# EAGLE schematic GBARPi (EAGLE 9.6.2)

## Sheet 1 of 3
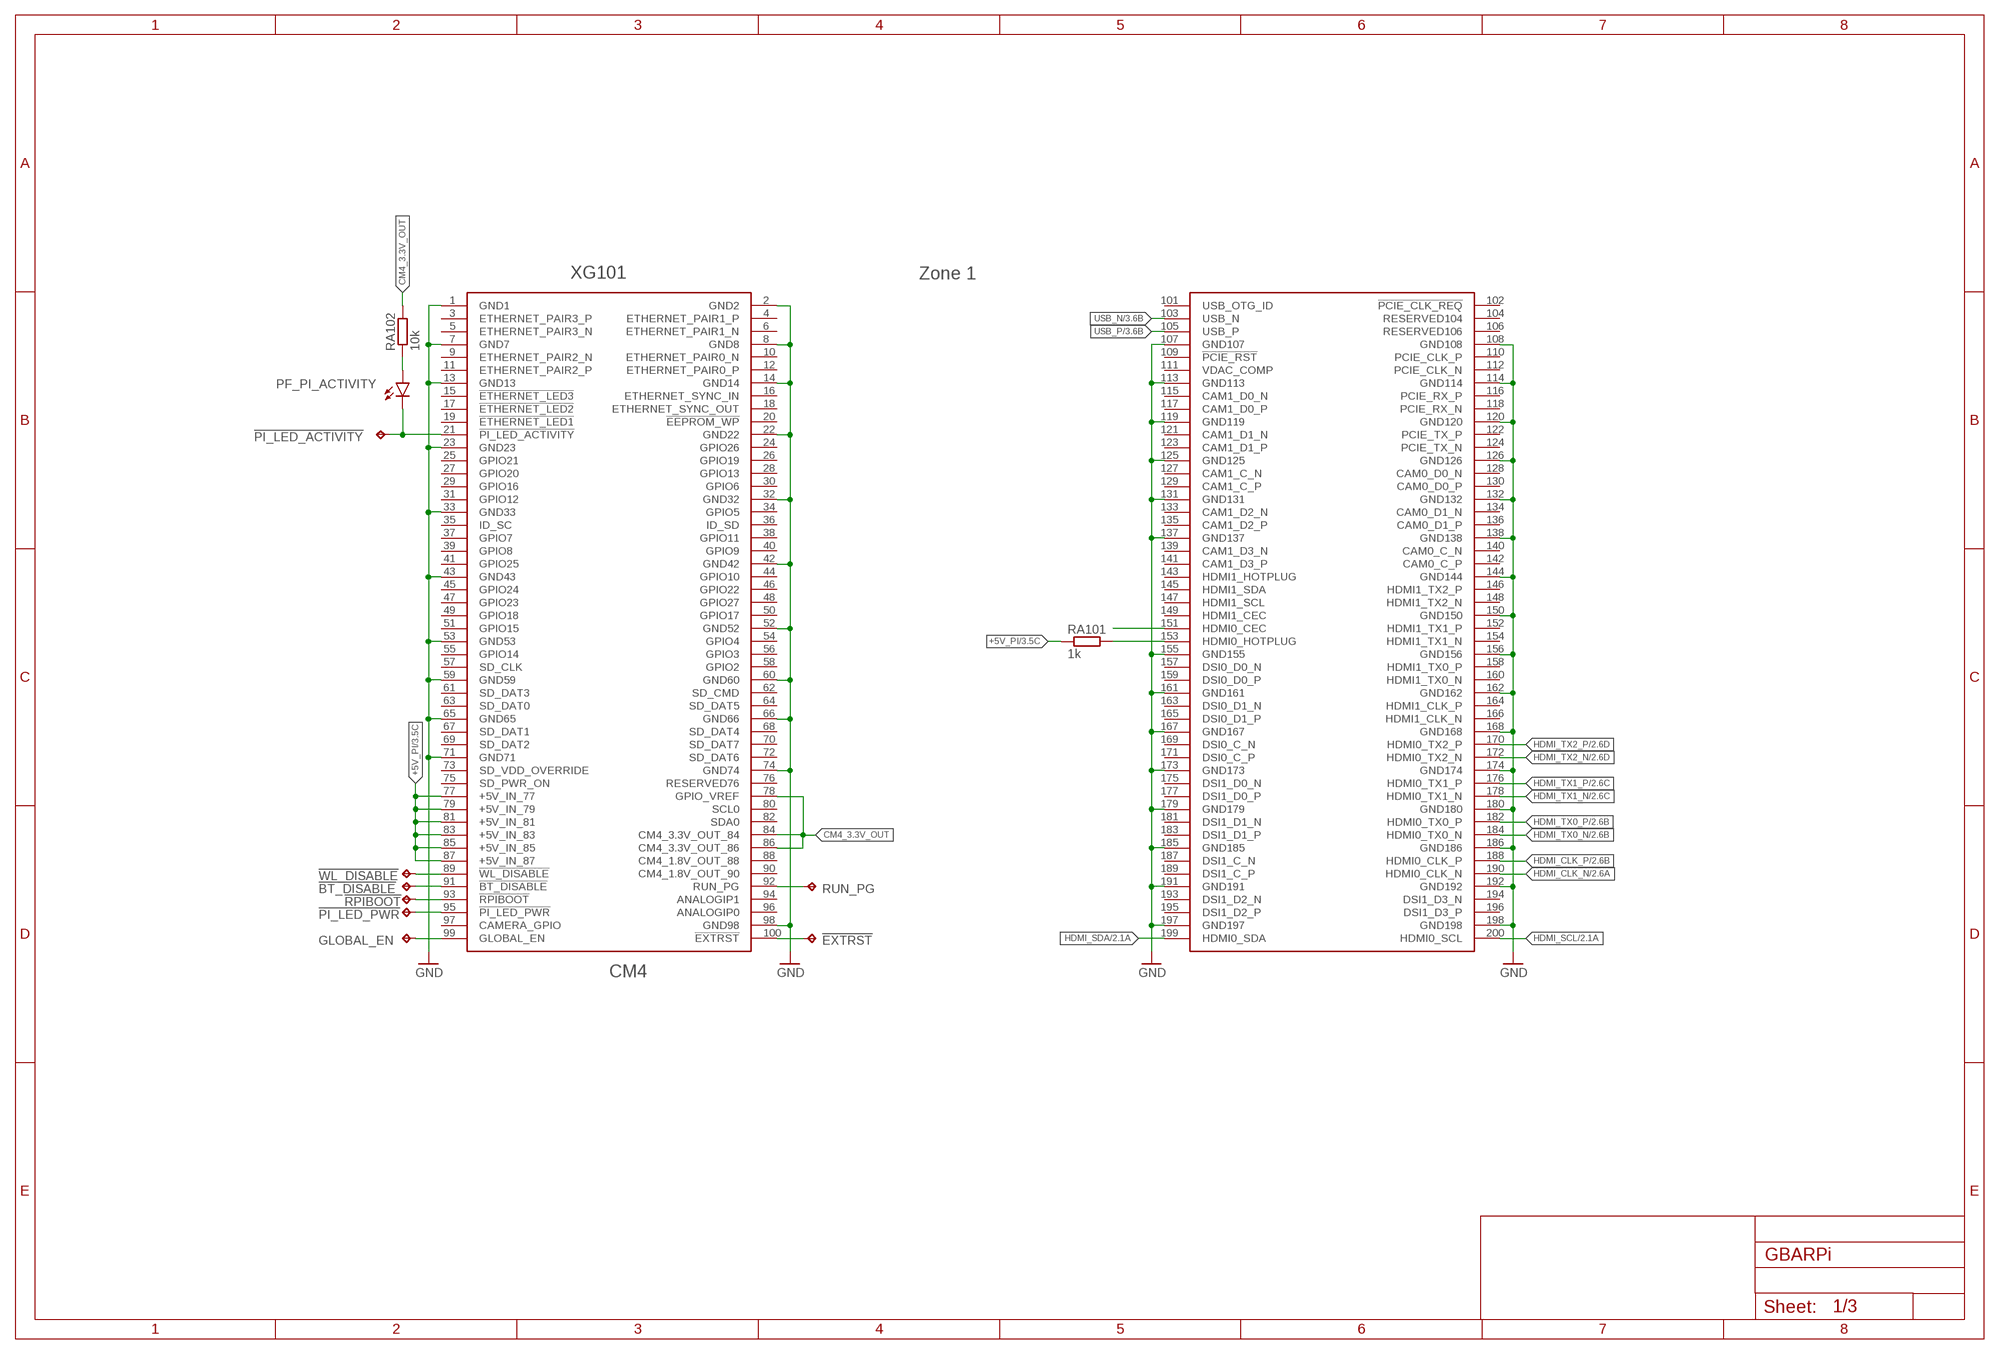
[diagram p0: schematic, sheet 1]

### Parts
!BT_DISABLE  TPB1,27  [B1,27]
!EXTRST  TPB1,27  [B1,27]
!PI_LED_ACTIVITY  TPB1,27  [B1,27]
!PI_LED_PWR  TPB1,27  [B1,27]
!RPIBOOT  TPB1,27  [B1,27]
!WL_DISABLE  TPB1,27  [B1,27]
GLOBAL_EN  TPB1,27  [B1,27]
PF_PI_ACTIVITY  LEDCHIP-LED0603  [CHIP-LED0603]
RA101  1k  R-EU_R0402  [R0402]
RA102  10k  R-EU_R0402  [R0402]
RUN_PG  TPB1,27  [B1,27]
XG101  CM4  [CM4]

### Nets
!BT_DISABLE: !BT_DISABLE.TP XG101.91(!BT_DISABLE)
!EXTRST: !EXTRST.TP XG101.100(!EXTRST)
!PI_LED_ACTIVITY: !PI_LED_ACTIVITY.TP PF_PI_ACTIVITY.C XG101.21(!PI_LED_ACTIVITY)
!PI_LED_PWR: !PI_LED_PWR.TP XG101.95(!PI_LED_PWR)
!RPIBOOT: !RPIBOOT.TP XG101.93(!RPIBOOT)
!WL_DISABLE: !WL_DISABLE.TP XG101.89(!WL_DISABLE)
+5V_PI: RA101.1 XG101.77(+5V_IN_77) XG101.79(+5V_IN_79) XG101.81(+5V_IN_81) XG101.83(+5V_IN_83) XG101.85(+5V_IN_85) XG101.87(+5V_IN_87) ; also sheet 3
CM4_3.3V_OUT: RA102.2 XG101.78(GPIO_VREF) XG101.84(CM4_3.3V_OUT_84) XG101.86(CM4_3.3V_OUT_86)
GLOBAL_EN: GLOBAL_EN.TP XG101.99(GLOBAL_EN)
GND: XG101.1(GND1) XG101.2(GND2) XG101.7(GND7) XG101.8(GND8) XG101.13(GND13) XG101.14(GND14) XG101.22(GND22) XG101.23(GND23) XG101.32(GND32) XG101.33(GND33) XG101.42(GND42) XG101.43(GND43) XG101.52(GND52) XG101.53(GND53) XG101.59(GND59) XG101.60(GND60) XG101.65(GND65) XG101.66(GND66) XG101.71(GND71) XG101.74(GND74) XG101.98(GND98) XG101.107(GND107) XG101.108(GND108) XG101.113(GND113) XG101.114(GND114) XG101.119(GND119) XG101.120(GND120) XG101.125(GND125) XG101.126(GND126) XG101.131(GND131) XG101.132(GND132) XG101.137(GND137) XG101.138(GND138) XG101.144(GND144) XG101.150(GND150) XG101.155(GND155) XG101.156(GND156) XG101.161(GND161) XG101.162(GND162) XG101.167(GND167) XG101.168(GND168) XG101.173(GND173) XG101.174(GND174) XG101.179(GND179) XG101.180(GND180) XG101.185(GND185) XG101.186(GND186) XG101.191(GND191) XG101.192(GND192) XG101.197(GND197) XG101.198(GND198) ; also sheet 2,3
HDMI_CLK_N [HDMI]: XG101.190(HDMI0_CLK_N) ; also sheet 2
HDMI_CLK_P [HDMI]: XG101.188(HDMI0_CLK_P) ; also sheet 2
HDMI_SCL: XG101.200(HDMI0_SCL) ; also sheet 2
HDMI_SDA: XG101.199(HDMI0_SDA) ; also sheet 2
HDMI_TX0_N [HDMI]: XG101.184(HDMI0_TX0_N) ; also sheet 2
HDMI_TX0_P [HDMI]: XG101.182(HDMI0_TX0_P) ; also sheet 2
HDMI_TX1_N [HDMI]: XG101.178(HDMI0_TX1_N) ; also sheet 2
HDMI_TX1_P [HDMI]: XG101.176(HDMI0_TX1_P) ; also sheet 2
HDMI_TX2_N [HDMI]: XG101.172(HDMI0_TX2_N) ; also sheet 2
HDMI_TX2_P [HDMI]: XG101.170(HDMI0_TX2_P) ; also sheet 2
N$1: XG101.151(HDMI0_CEC)
N$2: RA101.2 XG101.153(HDMI0_HOTPLUG)
N$12: PF_PI_ACTIVITY.A RA102.1
RUN_PG: RUN_PG.TP XG101.92(RUN_PG)
USB_N [USB]: XG101.103(USB_N) ; also sheet 3
USB_P [USB]: XG101.105(USB_P) ; also sheet 3
Unconnected: XG101.3(ETHERNET_PAIR3_P) XG101.4(ETHERNET_PAIR1_P) XG101.5(ETHERNET_PAIR3_N) XG101.6(ETHERNET_PAIR1_N) XG101.9(ETHERNET_PAIR2_N) XG101.10(ETHERNET_PAIR0_N) XG101.11(ETHERNET_PAIR2_P) XG101.12(ETHERNET_PAIR0_P) XG101.15(!ETHERNET_LED3) XG101.16(ETHERNET_SYNC_IN) XG101.17(!ETHERNET_LED2) XG101.18(ETHERNET_SYNC_OUT) XG101.19(!ETHERNET_LED1) XG101.20(!EEPROM_WP) XG101.24(GPIO26) XG101.25(GPIO21) XG101.26(GPIO19) XG101.27(GPIO20) XG101.28(GPIO13) XG101.29(GPIO16) XG101.30(GPIO6) XG101.31(GPIO12) XG101.34(GPIO5) XG101.35(ID_SC) XG101.36(ID_SD) XG101.37(GPIO7) XG101.38(GPIO11) XG101.39(GPIO8) XG101.40(GPIO9) XG101.41(GPIO25) XG101.44(GPIO10) XG101.45(GPIO24) XG101.46(GPIO22) XG101.47(GPIO23) XG101.48(GPIO27) XG101.49(GPIO18) XG101.50(GPIO17) XG101.51(GPIO15) XG101.54(GPIO4) XG101.55(GPIO14) XG101.56(GPIO3) XG101.57(SD_CLK) XG101.58(GPIO2) XG101.61(SD_DAT3) XG101.62(SD_CMD) XG101.63(SD_DAT0) XG101.64(SD_DAT5) XG101.67(SD_DAT1) XG101.68(SD_DAT4) XG101.69(SD_DAT2) XG101.70(SD_DAT7) XG101.72(SD_DAT6) XG101.73(SD_VDD_OVERRIDE) XG101.75(SD_PWR_ON) XG101.76(RESERVED76) XG101.80(SCL0) XG101.82(SDA0) XG101.88(CM4_1.8V_OUT_88) XG101.90(CM4_1.8V_OUT_90) XG101.94(ANALOGIP1) XG101.96(ANALOGIP0) XG101.97(CAMERA_GPIO) XG101.101(USB_OTG_ID) XG101.102(!PCIE_CLK_REQ) XG101.104(RESERVED104) XG101.106(RESERVED106) XG101.109(!PCIE_RST) XG101.110(PCIE_CLK_P) XG101.111(VDAC_COMP) XG101.112(PCIE_CLK_N) XG101.115(CAM1_D0_N) XG101.116(PCIE_RX_P) XG101.117(CAM1_D0_P) XG101.118(PCIE_RX_N) XG101.121(CAM1_D1_N) XG101.122(PCIE_TX_P) XG101.123(CAM1_D1_P) XG101.124(PCIE_TX_N) XG101.127(CAM1_C_N) XG101.128(CAM0_D0_N) XG101.129(CAM1_C_P) XG101.130(CAM0_D0_P) XG101.133(CAM1_D2_N) XG101.134(CAM0_D1_N) XG101.135(CAM1_D2_P) XG101.136(CAM0_D1_P) XG101.139(CAM1_D3_N) XG101.140(CAM0_C_N) XG101.141(CAM1_D3_P) XG101.142(CAM0_C_P) XG101.143(HDMI1_HOTPLUG) XG101.145(HDMI1_SDA) XG101.146(HDMI1_TX2_P) XG101.147(HDMI1_SCL) XG101.148(HDMI1_TX2_N) XG101.149(HDMI1_CEC) XG101.152(HDMI1_TX1_P) XG101.154(HDMI1_TX1_N) XG101.157(DSI0_D0_N) XG101.158(HDMI1_TX0_P) XG101.159(DSI0_D0_P) XG101.160(HDMI1_TX0_N) XG101.163(DSI0_D1_N) XG101.164(HDMI1_CLK_P) XG101.165(DSI0_D1_P) XG101.166(HDMI1_CLK_N) XG101.169(DSI0_C_N) XG101.171(DSI0_C_P) XG101.175(DSI1_D0_N) XG101.177(DSI1_D0_P) XG101.181(DSI1_D1_N) XG101.183(DSI1_D1_P) XG101.187(DSI1_C_N) XG101.189(DSI1_C_P) XG101.193(DSI1_D2_N) XG101.194(DSI1_D3_N) XG101.195(DSI1_D2_P) XG101.196(DSI1_D3_P)

### Notes on the sheet
- Zone 1

## Sheet 2 of 3
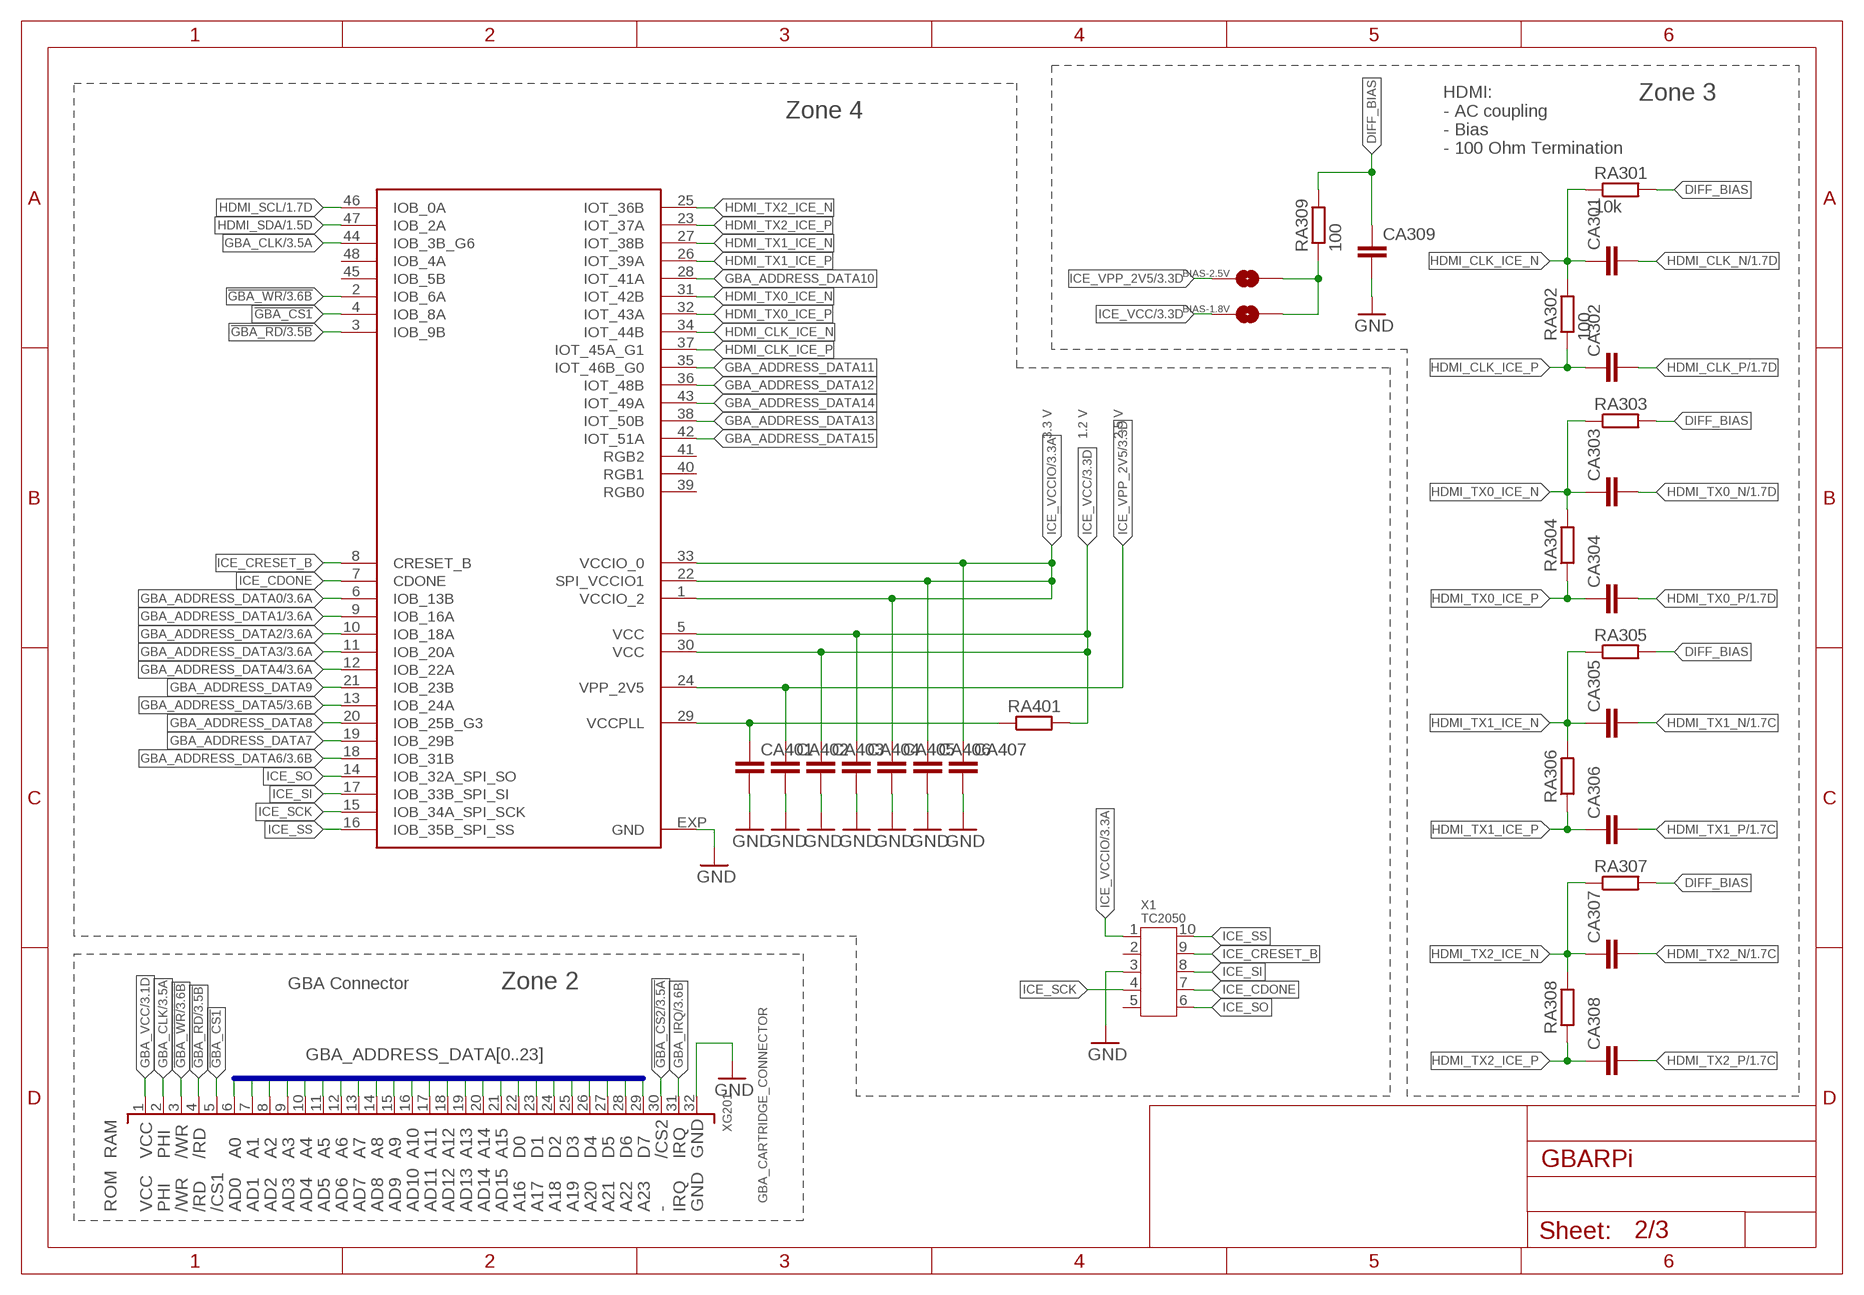
[diagram p1: schematic, sheet 2]

### Parts
BIAS-1.8V  SJS-NC3  [SJS-NC3]
BIAS-2.5V  SJ  [SJ]
CA301  C-EUC0402  [C0402]
CA302  C-EUC0402  [C0402]
CA303  C-EUC0402  [C0402]
CA304  C-EUC0402  [C0402]
CA305  C-EUC0402  [C0402]
CA306  C-EUC0402  [C0402]
CA307  C-EUC0402  [C0402]
CA308  C-EUC0402  [C0402]
CA309  C-EUC0402  [C0402]
CA401  C-EUC0402  [C0402]
CA402  C-EUC0402  [C0402]
CA403  C-EUC0402  [C0402]
CA404  C-EUC0402  [C0402]
CA405  C-EUC0402  [C0402]
CA406  C-EUC0402  [C0402]
CA407  C-EUC0402  [C0402]
KF401  ICE40UP5KSG48  [QFN50P700X700X100-49T535N]
RA301  10k  R-EU_R0402  [R0402]
RA302  100  R-EU_R0402  [R0402]
RA303  R-EU_R0402  [R0402]
RA304  R-EU_R0402  [R0402]
RA305  R-EU_R0402  [R0402]
RA306  R-EU_R0402  [R0402]
RA307  R-EU_R0402  [R0402]
RA308  R-EU_R0402  [R0402]
RA309  100  R-EU_R0402  [R0402]
RA401  R-EU_R0402  [R0402]
X1  TC2050  [TC2050]
XG201  GBA_CARTRIDGE_CONNECTOR  [GBA_CARTRIDGE_CONNECTOR]

### Nets
!GBA_CS1: KF401.4(IOB_8A) XG201.5(/RCS)
!GBA_CS2: XG201.30(/RS) ; also sheet 3
!GBA_RD: KF401.3(IOB_9B) XG201.4(/RD) ; also sheet 3
!GBA_WR: KF401.2(IOB_6A) XG201.3(/WR) ; also sheet 3
DIFF_BIAS: CA309.1 RA301.2 RA303.2 RA305.2 RA307.2 RA309.2
GBA_ADDRESS_DATA0: KF401.6(IOB_13B) XG201.6(A0) ; also sheet 3
GBA_ADDRESS_DATA1: KF401.9(IOB_16A) XG201.7(A1) ; also sheet 3
GBA_ADDRESS_DATA2: KF401.10(IOB_18A) XG201.8(A2) ; also sheet 3
GBA_ADDRESS_DATA3: KF401.11(IOB_20A) XG201.9(A3) ; also sheet 3
GBA_ADDRESS_DATA4: KF401.12(IOB_22A) XG201.10(A4) ; also sheet 3
GBA_ADDRESS_DATA5: KF401.13(IOB_24A) XG201.11(A5) ; also sheet 3
GBA_ADDRESS_DATA6: KF401.18(IOB_31B) XG201.12(A6) ; also sheet 3
GBA_ADDRESS_DATA7: KF401.19(IOB_29B) XG201.13(A7)
GBA_ADDRESS_DATA8: KF401.20(IOB_25B_G3) XG201.14(A8)
GBA_ADDRESS_DATA9: KF401.21(IOB_23B) XG201.15(A9)
GBA_ADDRESS_DATA10: KF401.28(IOT_41A) XG201.16(A10)
GBA_ADDRESS_DATA11: KF401.35(IOT_46B_G0) XG201.17(A11)
GBA_ADDRESS_DATA12: KF401.36(IOT_48B) XG201.18(A12)
GBA_ADDRESS_DATA13: KF401.38(IOT_50B) XG201.19(A13)
GBA_ADDRESS_DATA14: KF401.43(IOT_49A) XG201.20(A14)
GBA_ADDRESS_DATA15: KF401.42(IOT_51A) XG201.21(A15)
GBA_ADDRESS_DATA16: XG201.22(D0) ; also sheet 3
GBA_ADDRESS_DATA17: XG201.23(D1) ; also sheet 3
GBA_ADDRESS_DATA18: XG201.24(D2) ; also sheet 3
GBA_ADDRESS_DATA19: XG201.25(D3) ; also sheet 3
GBA_ADDRESS_DATA20: XG201.26(D4) ; also sheet 3
GBA_ADDRESS_DATA21: XG201.27(D5) ; also sheet 3
GBA_ADDRESS_DATA22: XG201.28(D6) ; also sheet 3
GBA_ADDRESS_DATA23: XG201.29(D7) ; also sheet 3
GBA_CLK: KF401.44(IOB_3B_G6) XG201.2(NC) ; also sheet 3
GBA_IRQ: XG201.31(VIN) ; also sheet 3
GBA_VCC: XG201.1(VDD) ; also sheet 3
GND: CA309.2 CA401.2 CA402.2 CA403.2 CA404.2 CA405.2 CA406.2 CA407.2 KF401.EXP(GND) X1.3 XG201.32(GND) ; also sheet 1,3
HDMI_CLK_ICE_N [HDMI]: CA301.1 KF401.34(IOT_44B) RA301.1 RA302.2
HDMI_CLK_ICE_P [HDMI]: CA302.1 KF401.37(IOT_45A_G1) RA302.1
HDMI_CLK_N [HDMI]: CA301.2 ; also sheet 1
HDMI_CLK_P [HDMI]: CA302.2 ; also sheet 1
HDMI_SCL: KF401.46(IOB_0A) ; also sheet 1
HDMI_SDA: KF401.47(IOB_2A) ; also sheet 1
HDMI_TX0_ICE_N [HDMI]: CA303.1 KF401.31(IOT_42B) RA303.1 RA304.2
HDMI_TX0_ICE_P [HDMI]: CA304.1 KF401.32(IOT_43A) RA304.1
HDMI_TX0_N [HDMI]: CA303.2 ; also sheet 1
HDMI_TX0_P [HDMI]: CA304.2 ; also sheet 1
HDMI_TX1_ICE_N: CA305.1 KF401.27(IOT_38B) RA305.1 RA306.2
HDMI_TX1_ICE_P: CA306.1 KF401.26(IOT_39A) RA306.1
HDMI_TX1_N [HDMI]: CA305.2 ; also sheet 1
HDMI_TX1_P [HDMI]: CA306.2 ; also sheet 1
HDMI_TX2_ICE_N: CA307.1 KF401.25(IOT_36B) RA307.1 RA308.2
HDMI_TX2_ICE_P: CA308.1 KF401.23(IOT_37A) RA308.1
HDMI_TX2_N [HDMI]: CA307.2 ; also sheet 1
HDMI_TX2_P [HDMI]: CA308.2 ; also sheet 1
ICE_CDONE: KF401.7(CDONE) X1.7
ICE_CRESET_B: KF401.8(CRESET_B) X1.9
ICE_SCK: KF401.15(IOB_34A_SPI_SCK) X1.4
ICE_SI: KF401.17(IOB_33B_SPI_SI) X1.8
ICE_SO: KF401.14(IOB_32A_SPI_SO) X1.6
ICE_SS: KF401.16(IOB_35B_SPI_SS) X1.10
ICE_VCC: BIAS-1.8V.1 CA403.1 CA404.1 KF401.5(VCC) KF401.30(VCC) RA401.2 ; also sheet 3
ICE_VCCIO: CA405.1 CA406.1 CA407.1 KF401.1(VCCIO_2) KF401.22(SPI_VCCIO1) KF401.33(VCCIO_0) X1.1 ; also sheet 3
ICE_VPP_2V5: BIAS-2.5V.1 CA402.1 KF401.24(VPP_2V5) ; also sheet 3
N$11: BIAS-1.8V.2 BIAS-2.5V.2 RA309.1
VCCPLL: CA401.1 KF401.29(VCCPLL) RA401.1
Unconnected: KF401.39(RGB0) KF401.40(RGB1) KF401.41(RGB2) KF401.45(IOB_5B) KF401.48(IOB_4A) X1.2 X1.5

### Buses
GBA_ADDRESS_DATA[0..23]

### Notes on the sheet
- Zone 3
- Zone 4
- HDMI:
  - AC coupling
  - Bias
  - 100 Ohm Termination
- 3.3 V | 1.2 V | 2.5 V
- GBA Connector | Zone 2

## Sheet 3 of 3
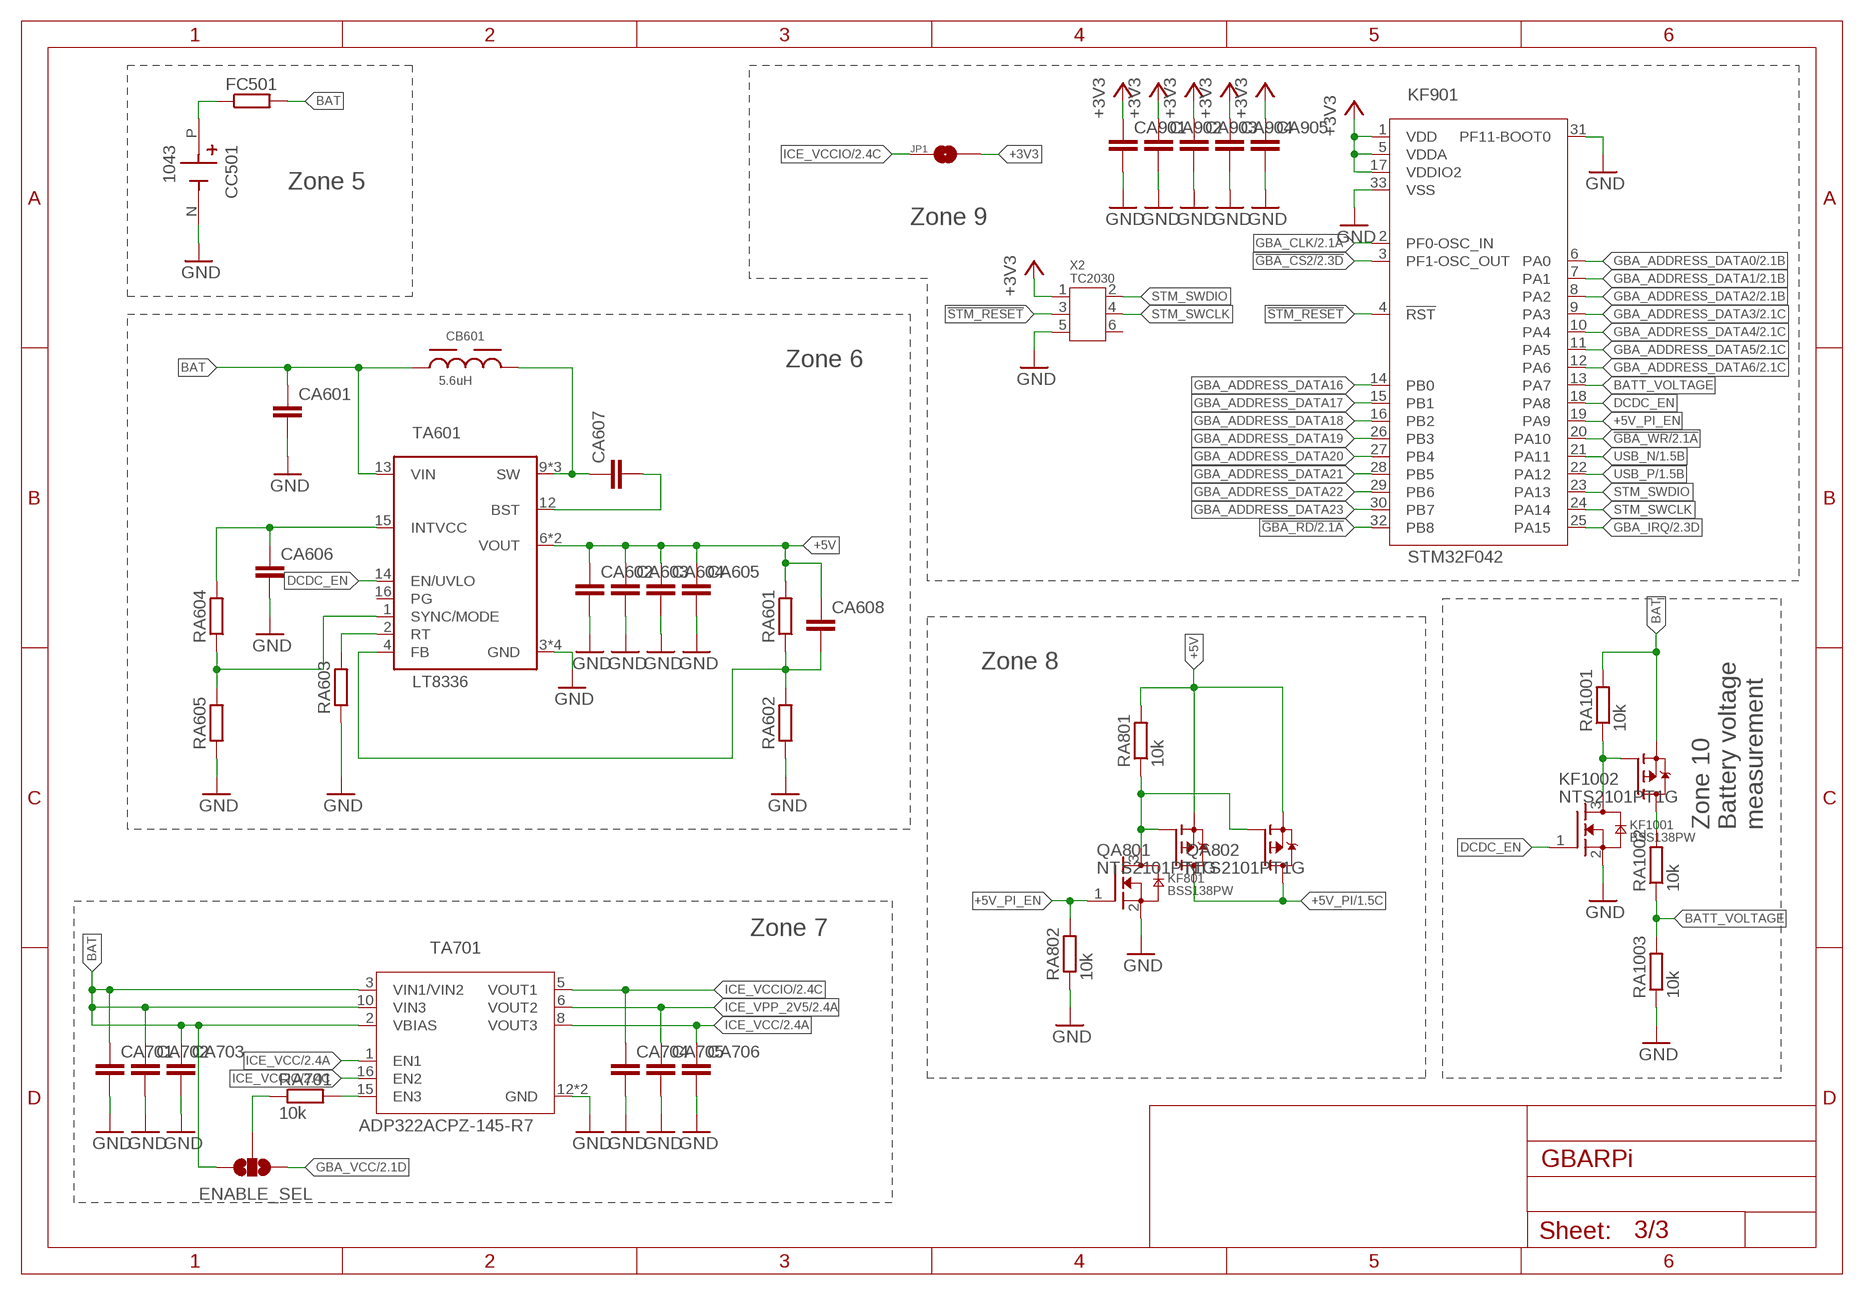
[diagram p2: schematic, sheet 3]

### Parts
CA601  C-EUC1206  [C1206]
CA602  C-EUC0603  [C0603]
CA603  C-EUC0603  [C0603]
CA604  C-EUC1206  [C1206]
CA605  C-EUC1206  [C1206]
CA606  C-EUC0402  [C0402]
CA607  C-EUC0402  [C0402]
CA608  C-EUC0402  [C0402]
CA701  C-EUC0402  [C0402]
CA702  C-EUC0402  [C0402]
CA703  C-EUC0402  [C0402]
CA704  C-EUC0402  [C0402]
CA705  C-EUC0402  [C0402]
CA706  C-EUC0402  [C0402]
CA901  C-EUC0402  [C0402]
CA902  C-EUC0402  [C0402]
CA903  C-EUC0402  [C0402]
CA904  C-EUC0402  [C0402]
CA905  C-EUC0402  [C0402]
CB601  5.6uH  WE-MAPI_4020_74438356056  [WE-MAPI_4020]
CC501  1043  [BAT_1043]
ENABLE_SEL  SJ2W  [SJ_2]
FC501  R-EU_R1206  [R1206]
JP1  SJS-NC3  [SJS-NC3]
KF801  BSS138PW  [SC70-3]
KF901  STM32F042  [QFN50P500X500X60-33T350N]
KF1001  BSS138PW  [SC70-3]
KF1002  NTS2101PT1G  [SC70-3]
QA801  NTS2101PT1G  [SC70-3]
QA802  NTS2101PT1G  [SC70-3]
RA601  R-EU_R0402  [R0402]
RA602  R-EU_R0402  [R0402]
RA603  R-EU_R0402  [R0402]
RA604  R-EU_R0402  [R0402]
RA605  R-EU_R0402  [R0402]
RA701  10k  R-EU_R0402  [R0402]
RA801  10k  R-EU_R0402  [R0402]
RA802  10k  R-EU_R0402  [R0402]
RA1001  10k  R-EU_R0402  [R0402]
RA1002  10k  R-EU_R0402  [R0402]
RA1003  10k  R-EU_R0402  [R0402]
TA601  LT8336  [LQFN16]
TA701  ADP322ACPZ-145-R7  ADP322ACPZ  [QFN50P300X300X80-17T175N]
X2  TC2030  [TC2030]

### Nets
!GBA_CS2: KF901.3(PF1-OSC_OUT) ; also sheet 2
!GBA_RD: KF901.32(PB8) ; also sheet 2
!GBA_WR: KF901.20(PA10) ; also sheet 2
!STM_RESET: KF901.4(!RST) X2.3
+3V3: CA901.1 CA902.1 CA903.1 CA904.1 CA905.1 JP1.2 KF901.1(VDD) KF901.5(VDDA) KF901.17(VDDIO2) X2.1
+5V: CA602.1 CA603.1 CA604.1 CA605.1 CA608.1 QA801.2(S) QA802.2(S) RA601.2 RA801.2 TA601.6(VOUT) TA601.7(VOUT)
+5V_PI: QA801.3(D) QA802.3(D) ; also sheet 1
+5V_PI_EN: KF801.1(G) KF901.19(PA9) RA802.2
BAT: CA601.1 CA701.1 CA702.1 CA703.1 CB601.1 ENABLE_SEL.3 FC501.2 KF1002.2(S) RA1001.2 TA601.13(VIN) TA701.2(VBIAS) TA701.3(VIN1/VIN2) TA701.10(VIN3)
BAT_UNFUSED: CC501.P FC501.1
BATT_VOLTAGE: KF901.13(PA7) RA1002.1 RA1003.2
DCDC_EN: KF901.18(PA8) KF1001.1(G) TA601.14(EN/UVLO)
GBA_ADDRESS_DATA0: KF901.6(PA0) ; also sheet 2
GBA_ADDRESS_DATA1: KF901.7(PA1) ; also sheet 2
GBA_ADDRESS_DATA2: KF901.8(PA2) ; also sheet 2
GBA_ADDRESS_DATA3: KF901.9(PA3) ; also sheet 2
GBA_ADDRESS_DATA4: KF901.10(PA4) ; also sheet 2
GBA_ADDRESS_DATA5: KF901.11(PA5) ; also sheet 2
GBA_ADDRESS_DATA6: KF901.12(PA6) ; also sheet 2
GBA_ADDRESS_DATA16: KF901.14(PB0) ; also sheet 2
GBA_ADDRESS_DATA17: KF901.15(PB1) ; also sheet 2
GBA_ADDRESS_DATA18: KF901.16(PB2) ; also sheet 2
GBA_ADDRESS_DATA19: KF901.26(PB3) ; also sheet 2
GBA_ADDRESS_DATA20: KF901.27(PB4) ; also sheet 2
GBA_ADDRESS_DATA21: KF901.28(PB5) ; also sheet 2
GBA_ADDRESS_DATA22: KF901.29(PB6) ; also sheet 2
GBA_ADDRESS_DATA23: KF901.30(PB7) ; also sheet 2
GBA_CLK: KF901.2(PF0-OSC_IN) ; also sheet 2
GBA_IRQ: KF901.25(PA15) ; also sheet 2
GBA_VCC: ENABLE_SEL.1 ; also sheet 2
GND: CA601.2 CA602.2 CA603.2 CA604.2 CA605.2 CA606.2 CA701.2 CA702.2 CA703.2 CA704.2 CA705.2 CA706.2 CA901.2 CA902.2 CA903.2 CA904.2 CA905.2 CC501.N KF801.2(S) KF901.31(PF11-BOOT0) KF901.33(VSS) KF1001.2(S) RA602.1 RA603.1 RA605.1 RA802.1 RA1003.1 TA601.3(GND) TA601.5(GND) TA601.8(GND) TA601.TH(GND) TA701.12(GND) TA701.17(GND) X2.5 ; also sheet 1,2
ICE_VCC: CA706.1 TA701.1(EN1) TA701.8(VOUT3) ; also sheet 2
ICE_VCCIO: CA704.1 JP1.1 TA701.5(VOUT1) TA701.16(EN2) ; also sheet 2
ICE_VPP_2V5: CA705.1 TA701.6(VOUT2) ; also sheet 2
LT8336_BST: CA607.2 TA601.12(BST)
N$3: CA608.2 RA601.1 RA602.2 TA601.4(FB)
N$4: CA607.1 CB601.2 TA601.9(SW) TA601.10(SW) TA601.11(SW)
N$5: RA603.2 TA601.2(RT)
N$6: RA604.1 RA605.2 TA601.1(SYNC/MODE)
N$7: KF801.3(D) QA801.1(G) QA802.1(G) RA801.1
N$8: CA606.1 RA604.2 TA601.15(INTVCC)
N$9: RA701.2 TA701.15(EN3)
N$10: ENABLE_SEL.2 RA701.1
N$14: KF1001.3(D) KF1002.1(G) RA1001.1
N$15: KF1002.3(D) RA1002.2
STM_SWCLK: KF901.24(PA14) X2.4
STM_SWDIO: KF901.23(PA13) X2.2
USB_N [USB]: KF901.21(PA11) ; also sheet 1
USB_P [USB]: KF901.22(PA12) ; also sheet 1
Unconnected: TA601.16(PG) X2.6

### Notes on the sheet
- Zone 5
- Zone 9
- Zone 6
- Zone 8
- Zone 10
  Battery voltage
  measurement
- Zone 7

## Library data of the parts
!BT_DISABLE !EXTRST !PI_LED_ACTIVITY !PI_LED_PWR !RPIBOOT !WL_DISABLE GLOBAL_EN RUN_PG = testpad:TP: Test pad
BIAS-1.8V BIAS-2.5V JP1 = q:SJ: SMD solder JUMPER
CA301-CA309 CA401-CA407 CA601-CA608 CA701-CA706 CA901-CA905 = rcl:C-EU: CAPACITOR, European symbol; SPICEPREFIX: C
CB601 = Wurth_Power Magnetics_WE-MAPI:WE-MAPI_4020: WE-MAPI SMD Power Inductor Characteristics Magnetic iron alloy allows high rated currents Compact design Magnetically shielded High current capability and handles high transient current spikes Low acoustic noise and low leakage flux noise Operating temperature: –40 °C to 125 °C Product and Application Spotlight: Stay cool, be MAPI Applications DC/DC-converter for high current power supplies DC/DC-converter for Field Programmable Gate Array (FPGA) POL-converters Portable power like PDA, digital camera Mainboards/graphic cards Battery powered devices Wireless communication devices Power supplies for smart- phones, tablet PCs and other mobile devices <https://katalog.we-online.com/media/images/v2/o14811v209%20Family_WE-MAPI.jpg> Details see: https://katalog.we-online.com/en/pbs/WE-MAPI Updated by Yingchun,Shan 2019-07-17 2019(C) Wurth Elektronik; DATASHEET-URL: https://www.we-online.com/catalog/datasheet/74438356056.pdf; FRES: 20MHz; IR: 2.8A; ISAT: 4.6A; MOUNT: SMT; PART-NUMBER: 74438356056; RDC-MAX: 81mOhm; RDC-TYP: 68mOhm
CC501 = c:1043: Battery Holder (Open) 18650 1 Cell PC Pin Check prices <https://pricing.snapeda.com/parts/1043/Keystone%20Electronics/view-part?ref=eda>; AVAILABILITY: Warning; DESCRIPTION: Battery Holder (Open) 18650 1 Cell PC Pin; MF: Keystone Electronics; MP: 1043; PACKAGE: Custom Package Keystone Electronics; PRICE: None; PURCHASE-URL: https://pricing.snapeda.com/search/part/1043/?ref=eda
ENABLE_SEL = q:SJ2W: SMD solder JUMPER
FC501 RA101 RA102 RA301-RA309 RA401 RA601-RA605 RA701 RA801 RA802 RA1001-RA1003 = rcl:R-EU_: RESISTOR, European symbol; SPICEPREFIX: R
KF401 = c:ICE40UP5K
KF801 KF1001 = q:BSS138PW
KF901 = c:STM32F042
KF1002 QA801 QA802 = q:NTS2101PT1G: MOSFET – Power, Single, P-Channel, SC-70, -8.0 V, -1.4 A
PF_PI_ACTIVITY = led:LED: LED OSRAM: - CHIPLED LG R971, LG N971, LY N971, LG Q971, LY Q971, LO R971, LY R971 LH N974, LH R974 LS Q976, LO Q976, LY Q976 LO Q996 - Hyper CHIPLED LW Q18S LB Q993, LB Q99A, LB R99A - SideLED LS A670, LO A670, LY A670, LG A670, LP A670 LB A673, LV A673, LT A673, LW A673 LH A674 LY A675 LS A676, LA A676, LO A676, LY A676, LW A676 LS A679, LY A679, LG A679 - Hyper Micro SIDELED® LS Y876, LA Y876, LO Y876, LY Y876 LT Y87S - SmartLED LW L88C, LW L88S LB L89C, LB L89S, LG L890 LS L89K, LO L89K, LY L89K LS L896, LA L896, LO L896, LY L896 - TOPLED LS T670, LO T670, LY T670, LG T670, LP T670 LSG T670, LSP T670, LSY T670, LOP T670, LYG T670 LG T671, LOG T671, LSG T671 LB T673, LV T673, LT T673, LW T673 LH T674 LS T676, LA T676, LO T676, LY T676, LB T676, LH T676, LSB T676, LW T676 LB T67C, LV T67C, LT T67C, LS T67K, LO T67K, LY T67K, LW E67C LS E67B, LA E67B, LO E67B, LY E67B, LB E67C, LV E67C, LT E67C LW T67C LS T679, LY T679, LG T679 LS T770, LO T770, LY T770, LG T770, LP T770 LB T773, LV T773, LT T773, LW T773 LH T774 LS E675, LA E675, LY E675, LS T675 LS T776, LA T776, LO T776, LY T776, LB T776 LHGB T686 LT T68C, LB T68C - Hyper Mini TOPLED® LB M676 - Mini TOPLED Santana® LG M470 LS M47K, LO M47K, LY M47K Source: http://www.osram.convergy.de LUXEON: - LUMILED® LXK2-PW12-R00, LXK2-PW12-S00, LXK2-PW14-U00, LXK2-PW14-V00 LXK2-PM12-R00, LXK2-PM12-S00, LXK2-PM14-U00 LXK2-PE12-Q00, LXK2-PE12-R00, LXK2-PE12-S00, LXK2-PE14-T00, LXK2-PE14-U00 LXK2-PB12-K00, LXK2-PB12-L00, LXK2-PB12-M00, LXK2-PB14-N00, LXK2-PB14-P00, LXK2-PB14-Q00 LXK2-PR12-L00, LXK2-PR12-M00, LXK2-PR14-Q00, LXK2-PR14-R00 LXK2-PD12-Q00, LXK2-PD12-R00, LXK2-PD12-S00 LXK2-PH12-R00, LXK2-PH12-S00 LXK2-PL12-P00, LXK2-PL12-Q00, LXK2-PL12-R00 Source: www.luxeon.com KINGBRIGHT: KA-3528ASYC Source: www.kingbright.com
TA601 = c:LT8336
TA701 = c:ADP322: Triple, 200 mA, Low Noise,High PSRR Voltage Regulator
X1 = q:TC2050: Tag-Connect In Circuit Programming & Debug Cable with IDC connector, 10 Pin Sources: http://www.tag-connect.com/TC2050-IDC http://www.tag-connect.com/TC2050-IDC-NL
X2 = q:TC2030: Tag-Connect In Circuit Programming & Debug Cable with IDC connector, 6 Pin Sources: http://www.tag-connect.com/TC2030-IDC http://www.tag-connect.com/TC2030-MCP http://www.tag-connect.com/TC2030-IDC-NL http://www.tag-connect.com/TC2030-MCP-NL
XG101 = c:CM4
XG201 = c:GBA_CARTRIDGE_CONNECTOR: Connector Pads for Gameboy Cartridges

## Net classes
1 HDMI: width 0.12 mm, clearance 0.15 mm
2 USB: width 0.12 mm, clearance 0.15 mm